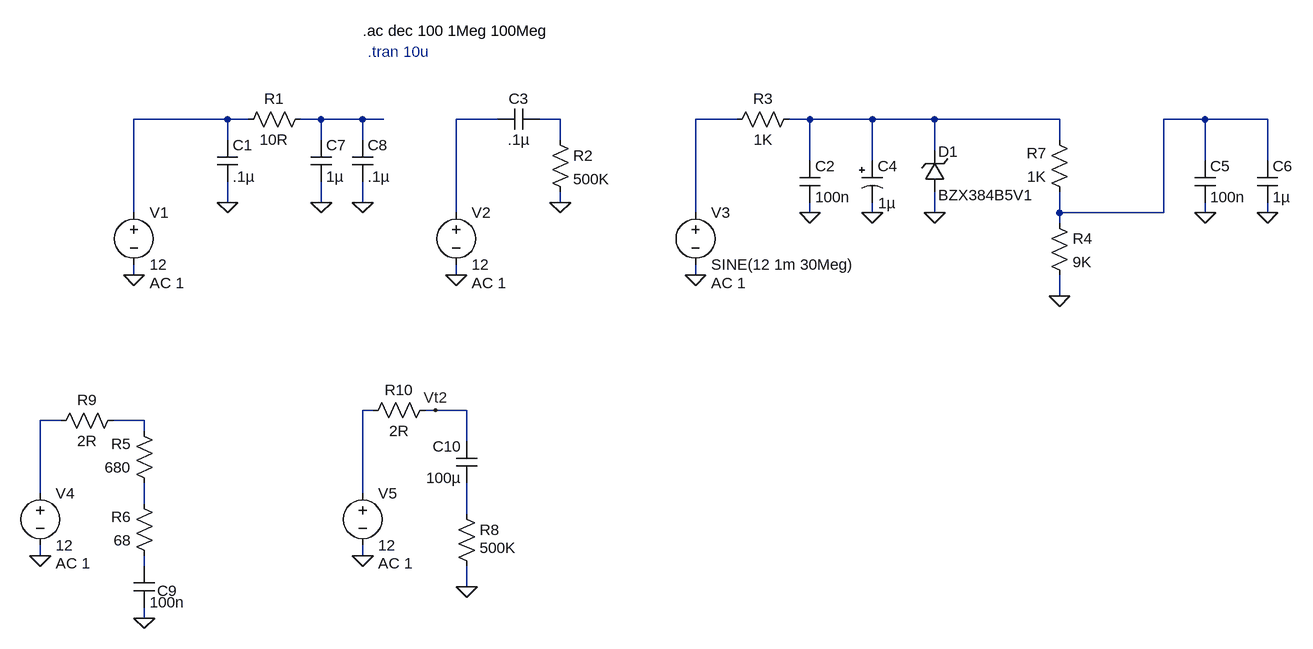
[diagram p0: schematic RC Filter.asc]
RC Filter.asc, the LTspice schematic file:
Version 4
SHEET 1 1672 756
WIRE 32 -32 -112 -32
WIRE 64 -32 32 -32
WIRE 176 -32 144 -32
WIRE 240 -32 176 -32
WIRE 272 -32 240 -32
WIRE 448 -32 384 -32
WIRE 544 -32 512 -32
WIRE 816 -32 752 -32
WIRE 928 -32 896 -32
WIRE 1024 -32 928 -32
WIRE 1120 -32 1024 -32
WIRE 1312 -32 1120 -32
WIRE 1536 -32 1472 -32
WIRE 1632 -32 1536 -32
WIRE 32 0 32 -32
WIRE 176 0 176 -32
WIRE 240 0 240 -32
WIRE 544 0 544 -32
WIRE 1312 0 1312 -32
WIRE 1120 16 1120 -32
WIRE 928 32 928 -32
WIRE 1024 32 1024 -32
WIRE 1536 32 1536 -32
WIRE 1632 32 1632 -32
WIRE 32 96 32 64
WIRE 176 96 176 64
WIRE 240 96 240 64
WIRE 544 96 544 80
WIRE -112 112 -112 -32
WIRE 384 112 384 -32
WIRE 752 112 752 -32
WIRE 928 112 928 96
WIRE 1024 112 1024 96
WIRE 1120 112 1120 80
WIRE 1312 112 1312 80
WIRE 1472 112 1472 -32
WIRE 1472 112 1312 112
WIRE 1536 112 1536 96
WIRE 1632 112 1632 96
WIRE 1312 128 1312 112
WIRE -112 208 -112 192
WIRE 384 208 384 192
WIRE 752 208 752 192
WIRE 1312 240 1312 208
WIRE 256 416 240 416
WIRE 352 416 336 416
WIRE 400 416 352 416
WIRE -224 432 -256 432
WIRE -96 432 -144 432
WIRE -96 448 -96 432
WIRE 400 464 400 416
WIRE -256 544 -256 432
WIRE 240 544 240 416
WIRE -96 560 -96 528
WIRE 400 576 400 528
WIRE -256 640 -256 624
WIRE 240 640 240 624
WIRE -96 656 -96 640
WIRE 400 688 400 656
WIRE -96 736 -96 720
FLAG -112 208 0
FLAG 544 96 0
FLAG 384 208 0
FLAG 752 208 0
FLAG 928 112 0
FLAG 1024 112 0
FLAG 1536 112 0
FLAG 1632 112 0
FLAG 1120 112 0
FLAG 1312 240 0
FLAG 176 96 0
FLAG 32 96 0
FLAG 240 96 0
FLAG -96 736 0
FLAG 352 416 Vt2
FLAG 400 688 0
FLAG -256 640 0
FLAG 240 640 0
SYMBOL voltage -112 96 R0
WINDOW 123 24 124 Left 2
WINDOW 39 0 0 Left 2
SYMATTR Value2 AC 1
SYMATTR InstName V1
SYMATTR Value 12
SYMBOL cap 16 0 R0
SYMATTR InstName C1
SYMATTR Value .1µ
SYMBOL res 160 -48 R90
WINDOW 0 0 56 VBottom 2
WINDOW 3 32 56 VTop 2
SYMATTR InstName R1
SYMATTR Value 10R
SYMBOL cap 512 -48 R90
WINDOW 0 0 32 VBottom 2
WINDOW 3 32 32 VTop 2
SYMATTR InstName C3
SYMATTR Value .1µ
SYMBOL res 528 -16 R0
SYMATTR InstName R2
SYMATTR Value 500K
SYMBOL voltage 384 96 R0
WINDOW 123 24 124 Left 2
WINDOW 39 0 0 Left 2
SYMATTR Value2 AC 1
SYMATTR InstName V2
SYMATTR Value 12
SYMBOL voltage 752 96 R0
WINDOW 123 24 124 Left 2
WINDOW 39 0 0 Left 2
SYMATTR Value2 AC 1
SYMATTR InstName V3
SYMATTR Value SINE(12 1m 30Meg)
SYMBOL cap 912 32 R0
SYMATTR InstName C2
SYMATTR Value 100n
SYMBOL res 912 -48 R90
WINDOW 0 0 56 VBottom 2
WINDOW 3 32 56 VTop 2
SYMATTR InstName R3
SYMATTR Value 1K
SYMBOL polcap 1008 32 R0
WINDOW 3 25 65 Left 2
SYMATTR Value 1µ
SYMATTR InstName C4
SYMATTR Description Capacitor
SYMATTR Type cap
SYMATTR SpiceLine V=50 Irms=6.2m Rser=2.66795 Lser=851.833p mfg="Würth Elektronik" pn="865230640005 WCAP-AS5H 4x5,5" type="Al electrolytic"
SYMBOL res 1328 96 R180
WINDOW 0 36 76 Left 2
WINDOW 3 36 40 Left 2
SYMATTR InstName R7
SYMATTR Value 1K
SYMBOL cap 1520 32 R0
SYMATTR InstName C5
SYMATTR Value 100n
SYMBOL cap 1616 32 R0
SYMATTR InstName C6
SYMATTR Value 1µ
SYMBOL zener 1136 80 R180
WINDOW 0 -20 62 Left 2
WINDOW 3 -135 -5 Left 2
SYMATTR InstName D1
SYMATTR Value BZX384B5V1
SYMATTR Description Diode
SYMATTR Type diode
SYMBOL res 1296 112 R0
SYMATTR InstName R4
SYMATTR Value 9K
SYMBOL cap 160 0 R0
SYMATTR InstName C7
SYMATTR Value 1µ
SYMBOL cap 224 0 R0
SYMATTR InstName C8
SYMATTR Value .1µ
SYMBOL res -80 544 R180
WINDOW 0 36 76 Left 2
WINDOW 3 36 40 Left 2
SYMATTR InstName R5
SYMATTR Value 680
SYMBOL res -80 656 R180
WINDOW 0 36 76 Left 2
WINDOW 3 36 40 Left 2
SYMATTR InstName R6
SYMATTR Value 68
SYMBOL cap -112 656 R0
WINDOW 0 36 38 Left 2
SYMATTR InstName C9
SYMATTR Value 100n
SYMBOL cap 416 528 R180
WINDOW 0 24 56 Left 2
WINDOW 3 24 8 Left 2
SYMATTR InstName C10
SYMATTR Value 100µ
SYMBOL res 384 560 R0
WINDOW 3 36 68 Left 2
SYMATTR Value 500K
SYMATTR InstName R8
SYMBOL voltage -256 528 R0
WINDOW 123 24 124 Left 2
WINDOW 39 0 0 Left 2
SYMATTR Value2 AC 1
SYMATTR InstName V4
SYMATTR Value 12
SYMBOL voltage 240 528 R0
WINDOW 123 24 124 Left 2
WINDOW 39 0 0 Left 2
SYMATTR Value2 AC 1
SYMATTR InstName V5
SYMATTR Value 12
SYMBOL res -128 416 R90
WINDOW 0 0 56 VBottom 2
WINDOW 3 32 56 VTop 2
SYMATTR InstName R9
SYMATTR Value 2R
SYMBOL res 352 400 R90
WINDOW 0 0 56 VBottom 2
WINDOW 3 32 56 VTop 2
SYMATTR InstName R10
SYMATTR Value 2R
TEXT 240 -168 Left 2 !.ac dec 100 1Meg 100Meg
TEXT 248 -136 Left 2 ;.tran 10u

The netlist it stands for:
* RC Filter.asc
V1 N001 0 12 AC 1
C1 N001 0 .1µ
R1 N002 N001 10R
C3 N004 N003 .1µ
R2 N004 0 500K
V2 N003 0 12 AC 1
V3 N005 0 SINE(12 1m 30Meg) AC 1
C2 N006 0 100n
R3 N006 N005 1K
C4 N006 0 1µ V=50 Irms=6.2m Rser=2.66795 Lser=851.833p mfg="Würth Elektronik" pn="865230640005 WCAP-AS5H 4x5,5" type="Al electrolytic"
R7 N007 N006 1K
C5 N007 0 100n
C6 N007 0 1µ
D1 0 N006 BZX384B5V1
R4 N007 0 9K
C7 N002 0 1µ
C8 N002 0 .1µ
R5 N011 N010 680
R6 N013 N011 68
C9 N013 0 100n
C10 N012 Vt2 100µ
R8 N012 0 500K
V4 N009 0 12 AC 1
V5 N008 0 12 AC 1
R9 N010 N009 2R
R10 Vt2 N008 2R
.model D D
.lib standard.dio
.ac dec 100 1Meg 100Meg
* .tran 10u
.backanno
.end